# Altium schematic sheet Interface_Current_Sensor_1.SchDoc
size A4
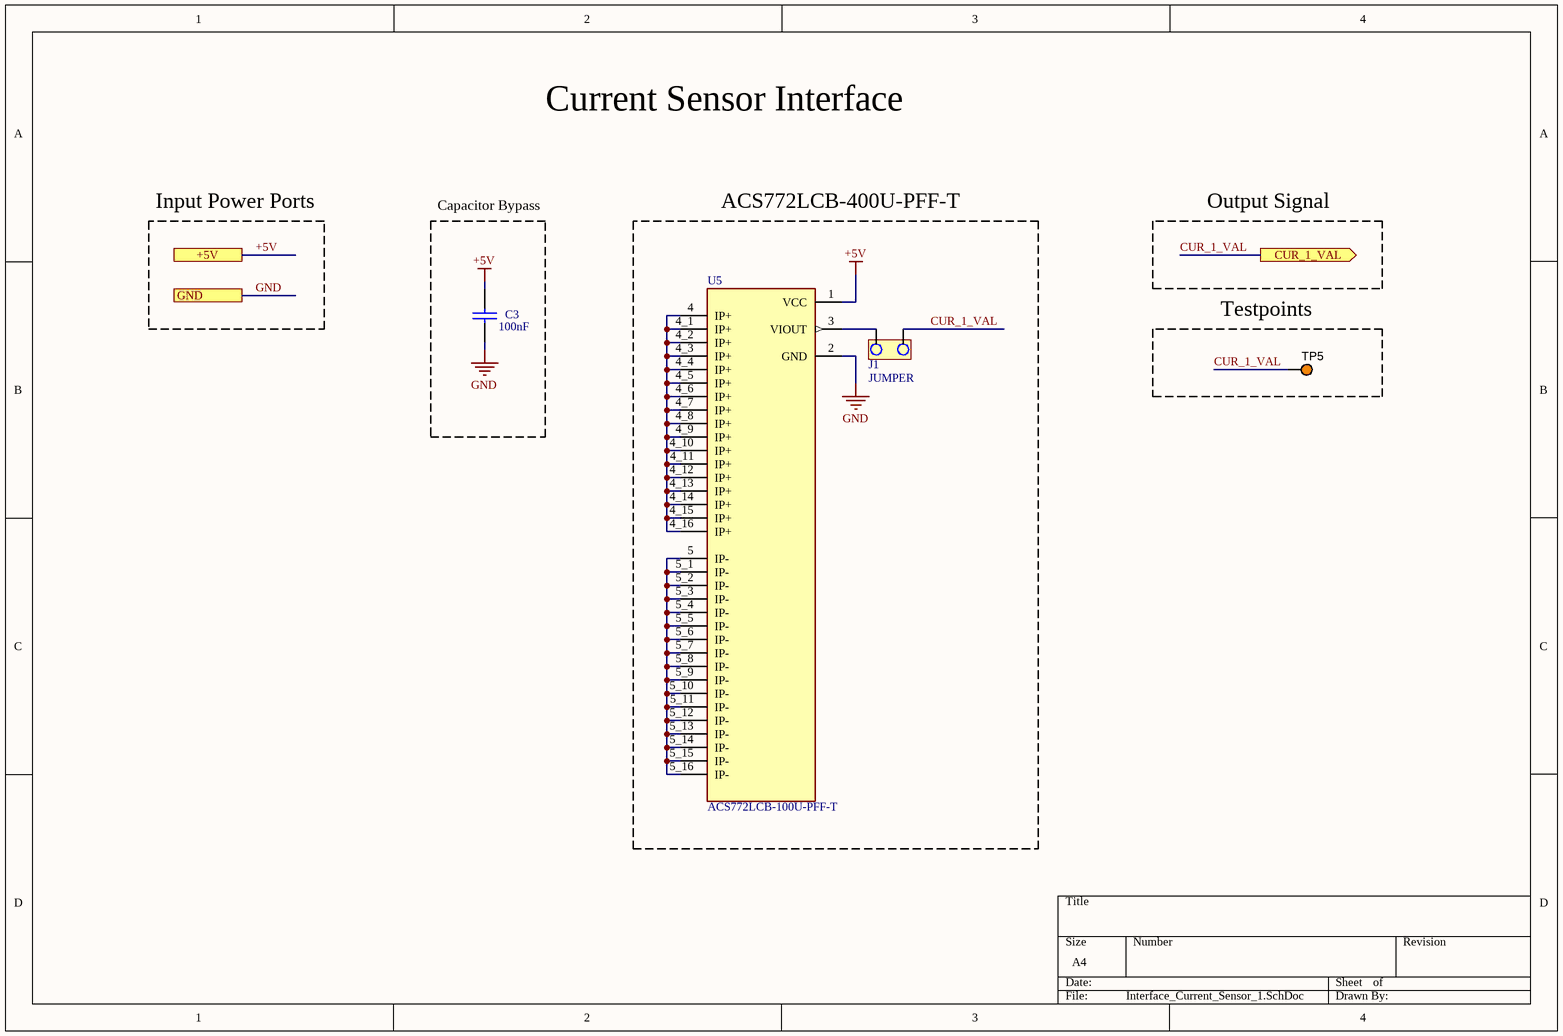
[diagram p0: Interface_Current_Sensor_1.SchDoc]

## Parts
C3  100nF  [CAP200]
J1  JUMPER  [JUMPER2]
TP5  5003  [KSTN-5003]  (value not drawn)
U5  ACS772LCB-100U-PFF-T  [XDCR_ACS772LCB-100U-PFF-T]

## Blocks framed on the sheet
Capacitor Bypass: C3
ACS772LCB-400U-PFF-T: J1 U5
Testpoints: TP5

## Ports
+5V, CUR_1_VAL (out), GND

## Nets
+5V: C3.1 U5.1(VCC) ; port +5V
GND: C3.2 U5.2(GND) ; port GND
CUR_1_VAL: J1.2 TP5.1 ; port CUR_1_VAL
NetJ1_1: J1.1 U5.3(VIOUT)
NetU5_4: U5.4(IP+) U5.4_1(IP+) U5.4_2(IP+) U5.4_3(IP+) U5.4_4(IP+) U5.4_5(IP+) U5.4_6(IP+) U5.4_7(IP+) U5.4_8(IP+) U5.4_9(IP+) U5.4_10(IP+) U5.4_11(IP+) U5.4_12(IP+) U5.4_13(IP+) U5.4_14(IP+) U5.4_15(IP+) U5.4_16(IP+)
NetU5_5: U5.5(IP-) U5.5_1(IP-) U5.5_2(IP-) U5.5_3(IP-) U5.5_4(IP-) U5.5_5(IP-) U5.5_6(IP-) U5.5_7(IP-) U5.5_8(IP-) U5.5_9(IP-) U5.5_10(IP-) U5.5_11(IP-) U5.5_12(IP-) U5.5_13(IP-) U5.5_14(IP-) U5.5_15(IP-) U5.5_16(IP-)

## Notes on the sheet
- Current Sensor Interface
- Input Power Ports
- Output Signal

## Library data of the parts
C3 = CAP
TP5 = CMP-002-00037-2: Test Point, Orange, Height 4.6 mm, Tail Length 3 mm, 1-Pin THD, RoHS; Manufacturer: Keystone; Colour: Orange; Packaging: Bulk; Package Description: 1-Pin Through Hole Device, Dia 2.54 mm; Pins: 1; Package Reference: 5003; Datasheet Version: Jun-15; Case/Package: 5003; Mounting Technology: TH; Connector Type: TestPoint; Diameter: 2.54mm; Contact Material: Bronze; Datasheet URL: http://keyelco.com/userAssets/file/M65p56.pdf; Manufacturer URL: http://www.keyelco.com/; Package Quantity: 10; Contact Plating: Tin; RoHS Compliant: True
U5 = CMP-029-000000-1: Current Sensor 100A 1 Channel Hall Effect Unidirectional 5-CB Formed Leads, PFF; MF: Allegro MicroSystems LLC; Check_prices: https://www.snapeda.com/parts/ACS772LCB-100U-PFF-T/Allegro%20MicroSystems%20LLC/view-part/2783431/?ref=eda; Availability: Bad; Arrow_Electronics-Purchase-URL: https://snapeda.com/shop?store=Arrow+Electronics&id=2783431; Value: *; Package: 5-CB-5 Allegro MicroSystems LLC; Source: ACS772LCB-100U-PFF-T.SchLib; Price: None; Design Item ID: ACS772LCB-100U-PFF-T; MP: ACS772LCB-100U-PFF-T; Pin Count: 37; Component Type: Standard; SnapEDA_Link: https://www.snapeda.com/parts/ACS772LCB-100U-PFF-T/Allegro%20MicroSystems%20LLC/view-part/2783431/?ref=snap